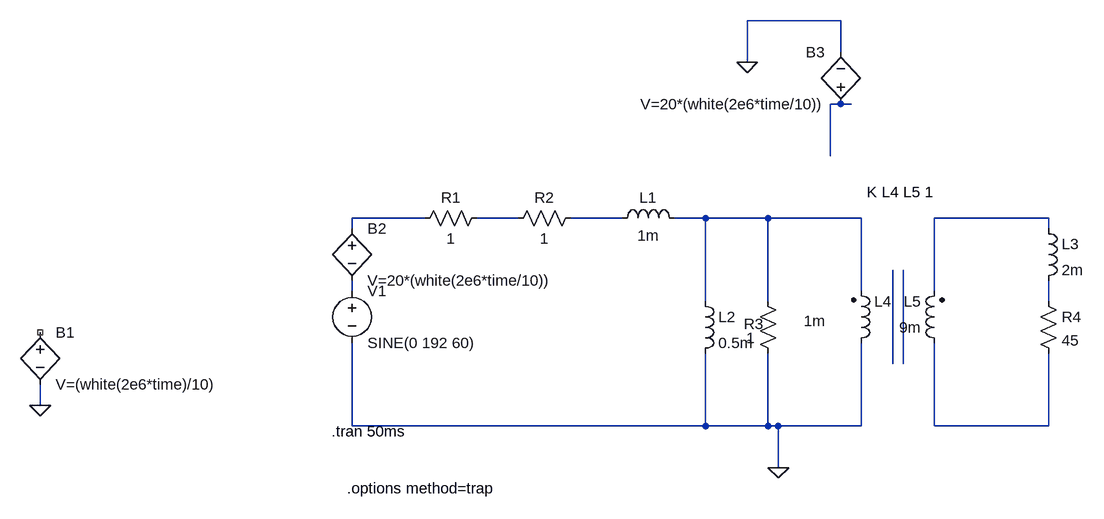
[diagram p0: schematic trafo.asc]
trafo.asc, the LTspice schematic file:
Version 4
SHEET 1 1004 680
WIRE 624 -256 480 -256
WIRE 624 -208 624 -256
WIRE 480 -192 480 -256
WIRE 624 -128 608 -128
WIRE 640 -128 624 -128
WIRE 608 -48 608 -128
WIRE -16 48 -128 48
WIRE 128 48 64 48
WIRE 288 48 208 48
WIRE 416 48 368 48
WIRE 512 48 416 48
WIRE 656 48 512 48
WIRE 944 48 768 48
WIRE -128 64 -128 48
WIRE 944 64 944 48
WIRE -128 160 -128 144
WIRE 656 160 656 48
WIRE 768 160 768 48
WIRE 416 176 416 48
WIRE 512 176 512 48
WIRE 944 176 944 144
WIRE 704 272 704 128
WIRE 720 272 720 128
WIRE -608 336 -608 304
WIRE -128 368 -128 240
WIRE 416 368 416 256
WIRE 416 368 -128 368
WIRE 512 368 512 256
WIRE 512 368 416 368
WIRE 528 368 512 368
WIRE 656 368 656 240
WIRE 656 368 528 368
WIRE 768 368 768 240
WIRE 944 368 944 256
WIRE 944 368 768 368
WIRE 528 432 528 368
FLAG 528 432 0
FLAG -608 336 0
FLAG 480 -192 0
SYMBOL res 80 32 R90
WINDOW 0 0 56 VBottom 2
WINDOW 3 32 56 VTop 2
SYMATTR InstName R1
SYMATTR Value 1
SYMBOL res 224 32 R90
WINDOW 0 0 56 VBottom 2
WINDOW 3 32 56 VTop 2
SYMATTR InstName R2
SYMATTR Value 1
SYMBOL res 528 272 R180
WINDOW 0 22 61 Left 2
WINDOW 3 36 40 Left 2
SYMATTR InstName R3
SYMATTR Value 1
SYMBOL res 928 160 R0
SYMATTR InstName R4
SYMATTR Value 45
SYMBOL ind 272 64 R270
WINDOW 0 32 56 VTop 2
WINDOW 3 5 56 VBottom 2
SYMATTR InstName L1
SYMATTR Value 1m
SYMBOL ind 400 160 R0
SYMATTR InstName L2
SYMATTR Value 0.5m
SYMBOL ind 928 48 R0
SYMATTR InstName L3
SYMATTR Value 2m
SYMBOL ind2 640 256 M180
WINDOW 0 36 80 Left 2
WINDOW 3 -73 50 Left 2
SYMATTR InstName L4
SYMATTR Value 1m
SYMATTR Type ind
SYMBOL ind2 784 256 R180
WINDOW 0 36 80 Left 2
WINDOW 3 36 40 Left 2
SYMATTR InstName L5
SYMATTR Value 9m
SYMATTR Type ind
SYMBOL voltage -128 144 R0
WINDOW 123 0 0 Left 0
WINDOW 39 0 0 Left 0
SYMATTR InstName V1
SYMATTR Value SINE(0 192 60)
SYMBOL bv -608 208 R0
SYMATTR InstName B1
SYMATTR Value V=(white(2e6*time)/10)
SYMBOL bv -128 48 R0
SYMATTR InstName B2
SYMATTR Value V=20*(white(2e6*time/10))
SYMBOL bv 624 -112 R180
WINDOW 0 24 96 Left 2
WINDOW 3 24 16 Left 2
SYMATTR InstName B3
SYMATTR Value V=20*(white(2e6*time/10))
TEXT -160 376 Left 2 !.tran 50ms
TEXT 664 8 Left 2 !K L4 L5 1
TEXT -136 464 Left 2 !.options method=trap

The netlist it stands for:
* trafo.asc
R1 N003 N002 1
R2 N004 N003 1
R3 0 N005 1
R4 N008 N011 45
L1 N004 N005 1m
L2 N005 0 0.5m
L3 N006 N008 2m
L4 0 N005 1m
L5 N011 N006 9m
V1 N007 0 SINE(0 192 60)
B1 NC_01 0 V=(white(2e6*time)/10)
B2 N002 N007 V=20*(white(2e6*time/10))
B3 N001 0 V=20*(white(2e6*time/10))
.tran 50ms
K L4 L5 1
.options method=trap
.backanno
.end